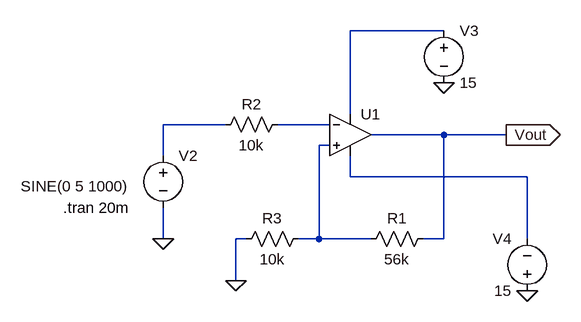
[diagram p0: schematic schmitt_trigger.asc]
schmitt_trigger.asc, the LTspice schematic file:
Version 4
SHEET 1 880 680
WIRE 352 -16 208 -16
WIRE 208 112 208 -16
WIRE 16 128 -80 128
WIRE 176 128 96 128
WIRE 352 144 240 144
WIRE 448 144 352 144
WIRE 176 160 160 160
WIRE -80 176 -80 128
WIRE 208 208 208 176
WIRE 480 208 208 208
WIRE -80 304 -80 256
WIRE 48 304 32 304
WIRE 160 304 160 160
WIRE 160 304 128 304
WIRE 240 304 160 304
WIRE 352 304 352 144
WIRE 352 304 320 304
WIRE 480 304 480 208
WIRE 32 368 32 304
FLAG 480 384 0
FLAG 352 64 0
FLAG -80 304 0
FLAG 32 368 0
FLAG 448 144 Vout
IOPIN 448 144 Out
SYMBOL OpAmps\\UniversalOpamp2 208 144 R0
SYMATTR InstName U1
SYMBOL voltage -80 160 R0
WINDOW 3 -219 63 Left 2
WINDOW 123 0 0 Left 0
WINDOW 39 0 0 Left 0
SYMATTR InstName V2
SYMATTR Value SINE(0 5 1000)
SYMBOL voltage 352 -32 R0
WINDOW 123 0 0 Left 0
WINDOW 39 0 0 Left 0
SYMATTR InstName V3
SYMATTR Value 15
SYMBOL voltage 480 400 R180
WINDOW 0 24 96 Left 2
WINDOW 3 24 16 Left 2
WINDOW 123 0 0 Left 0
WINDOW 39 0 0 Left 0
SYMATTR InstName V4
SYMATTR Value 15
SYMBOL res 112 112 R90
WINDOW 0 0 56 VBottom 2
WINDOW 3 32 56 VTop 2
SYMATTR InstName R2
SYMATTR Value 10k
SYMBOL res 336 288 R90
WINDOW 0 0 56 VBottom 2
WINDOW 3 32 56 VTop 2
SYMATTR InstName R1
SYMATTR Value 56k
SYMBOL res 144 288 R90
WINDOW 0 0 56 VBottom 2
WINDOW 3 32 56 VTop 2
SYMATTR InstName R3
SYMATTR Value 10k
TEXT -234 256 Left 2 !.tran 20m

The netlist it stands for:
* schmitt_trigger.asc
XU1 N004 N003 N001 N005 Vout level.2 Avol=1Meg GBW=10Meg Slew=10Meg ilimit=25m rail=0 Vos=0 phimargin=45 en=0 enk=0 in=0 ink=0 Rin=500Meg  ; pins IN+ IN- V+ V- OUT
V2 N002 0 SINE(0 5 1000)
V3 N001 0 15
V4 0 N005 15
R2 N003 N002 10k
R1 Vout N004 56k
R3 N004 0 10k
.tran 20m
.lib UniversalOpamps2.sub
.backanno
.end